# Altium schematic sheet chaves.SchDoc
size A3 portrait; SheetNumber: 4; SheetTotal: 7
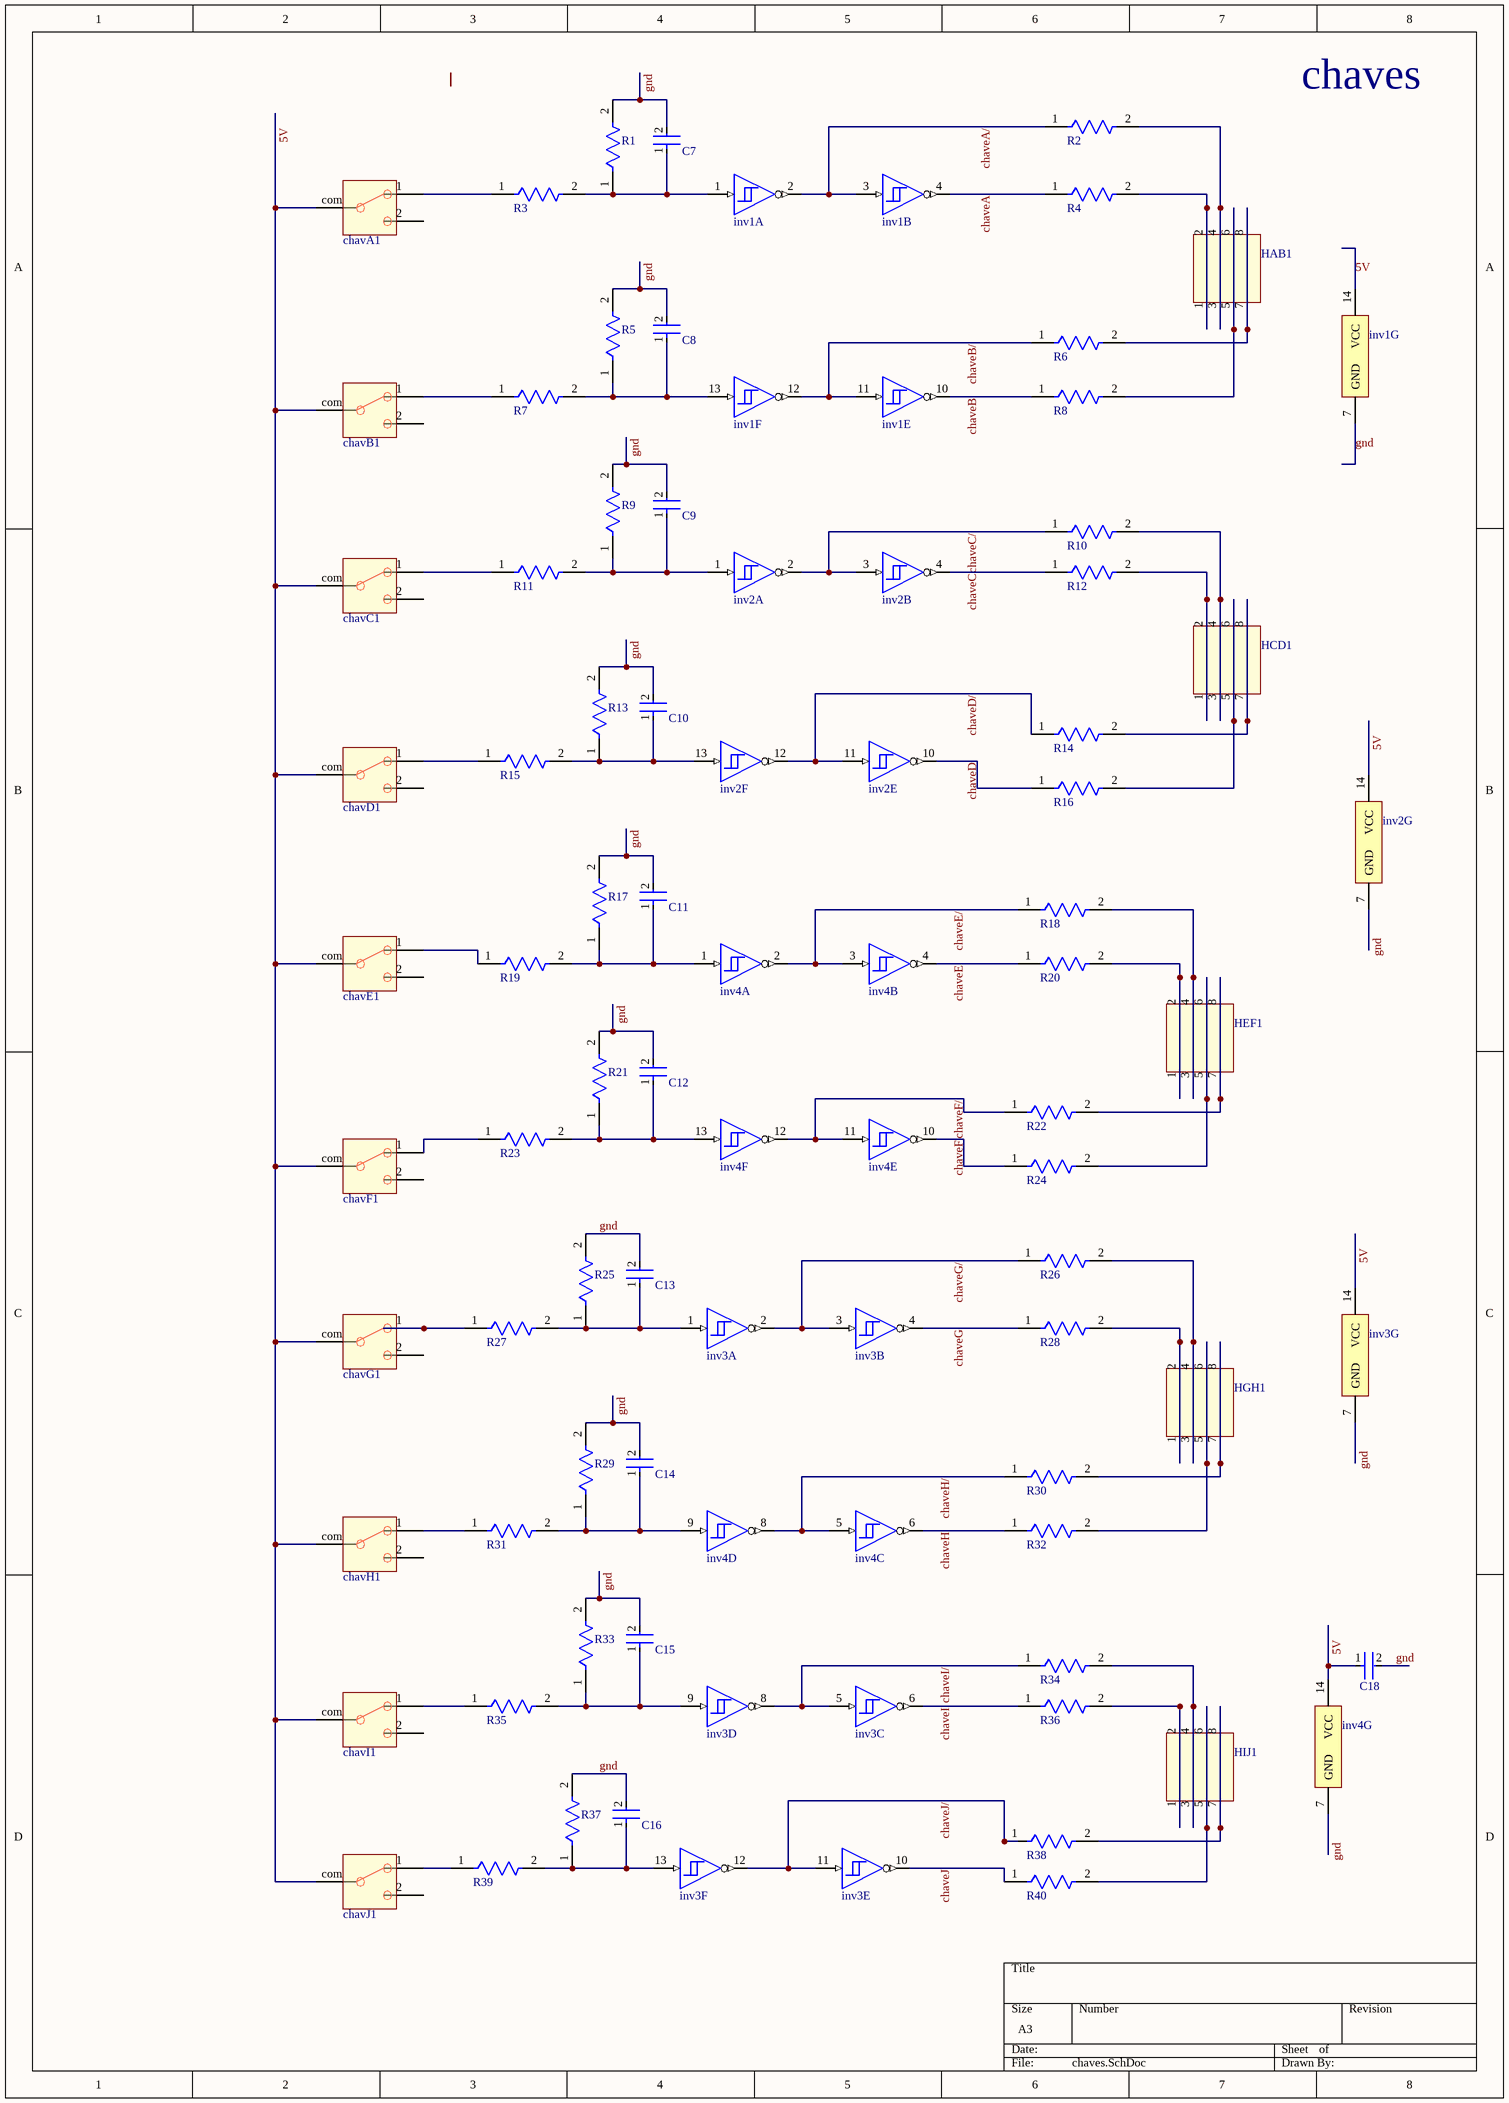
[diagram p0: chaves.SchDoc]

## Parts
C7  RCER71H335K3K1H03B  [FP-RCE3M1-MFG]  (value not drawn)
C8  RCER71H335K3K1H03B  [FP-RCE3M1-MFG]  (value not drawn)
C9  RCER71H335K3K1H03B  [FP-RCE3M1-MFG]  (value not drawn)
C10  RCER71H335K3K1H03B  [FP-RCE3M1-MFG]  (value not drawn)
C11  RCER71H335K3K1H03B  [FP-RCE3M1-MFG]  (value not drawn)
C12  RCER71H335K3K1H03B  [FP-RCE3M1-MFG]  (value not drawn)
C13  RCER71H335K3K1H03B  [FP-RCE3M1-MFG]  (value not drawn)
C14  RCER71H335K3K1H03B  [FP-RCE3M1-MFG]  (value not drawn)
C15  RCER71H335K3K1H03B  [FP-RCE3M1-MFG]  (value not drawn)
C16  RCER71H335K3K1H03B  [FP-RCE3M1-MFG]  (value not drawn)
C18  RCER71H335K3K1H03B  [FP-RCE3M1-MFG]  (value not drawn)
chavA1  chave MTS-102  [MTS-102]  (value not drawn)
chavB1  chave MTS-102  [MTS-102]  (value not drawn)
chavC1  chave MTS-102  [MTS-102]  (value not drawn)
chavD1  chave MTS-102  [MTS-102]  (value not drawn)
chavE1  chave MTS-102  [MTS-102]  (value not drawn)
chavF1  chave MTS-102  [MTS-102]  (value not drawn)
chavG1  chave MTS-102  [MTS-102]  (value not drawn)
chavH1  chave MTS-102  [MTS-102]  (value not drawn)
chavI1  chave MTS-102  [MTS-102]  (value not drawn)
chavJ1  chave MTS-102  [MTS-102]  (value not drawn)
HAB1  header 2x4  [header 2x4]  (value not drawn)
HCD1  header 2x4  [header 2x4]  (value not drawn)
HEF1  header 2x4  [header 2x4]  (value not drawn)
HGH1  header 2x4  [header 2x4]  (value not drawn)
HIJ1  header 2x4  [header 2x4]  (value not drawn)
inv1  SN74HC14N  [N0014A]  (value not drawn)  (parts A,B,E,F,G of 7)
inv2  SN74HC14N  [N0014A]  (value not drawn)  (parts A,B,E,F,G of 7)
inv3  SN74HC14N  [N0014A]  (value not drawn)  (parts A,B,C,D,E,F,G of 7)
inv4  SN74HC14N  [N0014A]  (value not drawn)  (parts A,B,C,D,E,F,G of 7)
R1  MRS16000C2002FCT00  [FP-MRS1600-MFG]  (value not drawn)
R2  MRS16000C2002FCT00  [FP-MRS1600-MFG]  (value not drawn)
R3  MRS16000C2002FCT00  [FP-MRS1600-MFG]  (value not drawn)
R4  MRS16000C2002FCT00  [FP-MRS1600-MFG]  (value not drawn)
R5  MRS16000C2002FCT00  [FP-MRS1600-MFG]  (value not drawn)
R6  MRS16000C2002FCT00  [FP-MRS1600-MFG]  (value not drawn)
R7  MRS16000C2002FCT00  [FP-MRS1600-MFG]  (value not drawn)
R8  MRS16000C2002FCT00  [FP-MRS1600-MFG]  (value not drawn)
R9  MRS16000C2002FCT00  [FP-MRS1600-MFG]  (value not drawn)
R10  MRS16000C2002FCT00  [FP-MRS1600-MFG]  (value not drawn)
R11  MRS16000C2002FCT00  [FP-MRS1600-MFG]  (value not drawn)
R12  MRS16000C2002FCT00  [FP-MRS1600-MFG]  (value not drawn)
R13  MRS16000C2002FCT00  [FP-MRS1600-MFG]  (value not drawn)
R14  MRS16000C2002FCT00  [FP-MRS1600-MFG]  (value not drawn)
R15  MRS16000C2002FCT00  [FP-MRS1600-MFG]  (value not drawn)
R16  MRS16000C2002FCT00  [FP-MRS1600-MFG]  (value not drawn)
R17  MRS16000C2002FCT00  [FP-MRS1600-MFG]  (value not drawn)
R18  MRS16000C2002FCT00  [FP-MRS1600-MFG]  (value not drawn)
R19  MRS16000C2002FCT00  [FP-MRS1600-MFG]  (value not drawn)
R20  MRS16000C2002FCT00  [FP-MRS1600-MFG]  (value not drawn)
R21  MRS16000C2002FCT00  [FP-MRS1600-MFG]  (value not drawn)
R22  MRS16000C2002FCT00  [FP-MRS1600-MFG]  (value not drawn)
R23  MRS16000C2002FCT00  [FP-MRS1600-MFG]  (value not drawn)
R24  MRS16000C2002FCT00  [FP-MRS1600-MFG]  (value not drawn)
R25  MRS16000C2002FCT00  [FP-MRS1600-MFG]  (value not drawn)
R26  MRS16000C2002FCT00  [FP-MRS1600-MFG]  (value not drawn)
R27  MRS16000C2002FCT00  [FP-MRS1600-MFG]  (value not drawn)
R28  MRS16000C2002FCT00  [FP-MRS1600-MFG]  (value not drawn)
R29  MRS16000C2002FCT00  [FP-MRS1600-MFG]  (value not drawn)
R30  MRS16000C2002FCT00  [FP-MRS1600-MFG]  (value not drawn)
R31  MRS16000C2002FCT00  [FP-MRS1600-MFG]  (value not drawn)
R32  MRS16000C2002FCT00  [FP-MRS1600-MFG]  (value not drawn)
R33  MRS16000C2002FCT00  [FP-MRS1600-MFG]  (value not drawn)
R34  MRS16000C2002FCT00  [FP-MRS1600-MFG]  (value not drawn)
R35  MRS16000C2002FCT00  [FP-MRS1600-MFG]  (value not drawn)
R36  MRS16000C2002FCT00  [FP-MRS1600-MFG]  (value not drawn)
R37  MRS16000C2002FCT00  [FP-MRS1600-MFG]  (value not drawn)
R38  MRS16000C2002FCT00  [FP-MRS1600-MFG]  (value not drawn)
R39  MRS16000C2002FCT00  [FP-MRS1600-MFG]  (value not drawn)
R40  MRS16000C2002FCT00  [FP-MRS1600-MFG]  (value not drawn)

## Nets
5V: C18.1 chavA1.com chavB1.com chavC1.com chavD1.com chavE1.com chavF1.com chavG1.com chavH1.com chavI1.com chavJ1.com inv1.14(VCC) inv2.14(VCC) inv3.14(VCC) inv4.14(VCC)
chaveA: inv1.4(~{2Y}) R4.1
chaveA/: inv1.2(~{1Y}) inv1.3(2A) R2.1
chaveB: inv1.10(~{5Y}) R8.1
chaveB/: inv1.11(5A) inv1.12(~{6Y}) R6.1
chaveC: inv2.4(~{2Y}) R12.1
chaveC/: inv2.2(~{1Y}) inv2.3(2A) R10.1
chaveD: inv2.10(~{5Y}) R16.1
chaveD/: inv2.11(5A) inv2.12(~{6Y}) R14.1
chaveE: inv4.4(~{2Y}) R20.1
chaveE/: inv4.2(~{1Y}) inv4.3(2A) R18.1
chaveF: inv4.10(~{5Y}) R24.1
chaveF/: inv4.11(5A) inv4.12(~{6Y}) R22.1
chaveG: inv3.4(~{2Y}) R28.1
chaveG/: inv3.2(~{1Y}) inv3.3(2A) R26.1
chaveH: inv4.6(~{3Y}) R32.1
chaveH/: inv4.5(3A) inv4.8(~{4Y}) R30.1
chaveI: inv3.6(~{3Y}) R36.1
chaveI/: inv3.5(3A) inv3.8(~{4Y}) R34.1
chaveJ: inv3.10(~{5Y}) R40.1
chaveJ/: inv3.11(5A) inv3.12(~{6Y}) R38.1
gnd: C7.2 C8.2 C9.2 C10.2 C11.2 C12.2 C13.2 C14.2 C15.2 C16.2 C18.2 inv1.7(GND) inv2.7(GND) inv3.7(GND) inv4.7(GND) R1.2 R5.2 R9.2 R13.2 R17.2 R21.2 R25.2 R29.2 R33.2 R37.2
NetC7_1: C7.1 inv1.1(1A) R1.1 R3.2
NetC8_1: C8.1 inv1.13(6A) R5.1 R7.2
NetC9_1: C9.1 inv2.1(1A) R9.1 R11.2
NetC10_1: C10.1 inv2.13(6A) R13.1 R15.2
NetC11_1: C11.1 inv4.1(1A) R17.1 R19.2
NetC12_1: C12.1 inv4.13(6A) R21.1 R23.2
NetC13_1: C13.1 inv3.1(1A) R25.1 R27.2
NetC14_1: C14.1 inv4.9(4A) R29.1 R31.2
NetC15_1: C15.1 inv3.9(4A) R33.1 R35.2
NetC16_1: C16.1 inv3.13(6A) R37.1 R39.2
NetchavA1_1: chavA1.1 R3.1
NetchavB1_1: chavB1.1 R7.1
NetchavC1_1: chavC1.1 R11.1
NetchavD1_1: chavD1.1 R15.1
NetchavE1_1: chavE1.1 R19.1
NetchavF1_1: chavF1.1 R23.1
NetchavG1_1: chavG1.1 R27.1
NetchavH1_1: chavH1.1 R31.1
NetchavI1_1: chavI1.1 R35.1
NetchavJ1_1: chavJ1.1 R39.1
NetHAB1_1: HAB1.1 HAB1.2 R4.2
NetHAB1_3: HAB1.3 HAB1.4 R2.2
NetHAB1_5: HAB1.5 HAB1.6 R8.2
NetHAB1_7: HAB1.7 HAB1.8 R6.2
NetHCD1_1: HCD1.1 HCD1.2 R12.2
NetHCD1_3: HCD1.3 HCD1.4 R10.2
NetHCD1_5: HCD1.5 HCD1.6 R16.2
NetHCD1_7: HCD1.7 HCD1.8 R14.2
NetHEF1_1: HEF1.1 HEF1.2 R20.2
NetHEF1_3: HEF1.3 HEF1.4 R18.2
NetHEF1_5: HEF1.5 HEF1.6 R24.2
NetHEF1_7: HEF1.7 HEF1.8 R22.2
NetHGH1_1: HGH1.1 HGH1.2 R28.2
NetHGH1_3: HGH1.3 HGH1.4 R26.2
NetHGH1_5: HGH1.5 HGH1.6 R32.2
NetHGH1_7: HGH1.7 HGH1.8 R30.2
NetHIJ1_1: HIJ1.1 HIJ1.2 R36.2
NetHIJ1_3: HIJ1.3 HIJ1.4 R34.2
NetHIJ1_5: HIJ1.5 HIJ1.6 R40.2
NetHIJ1_7: HIJ1.7 HIJ1.8 R38.2

Not connected (* = marked no-connect by the designer): chavA1 2; chavB1 2; chavC1 2; chavD1 2; chavE1 2; chavF1 2; chavG1 2; chavH1 2; chavI1 2; chavJ1 2

## Notes on the sheet
- chaves

## Library data of the parts
C7-C16 C18 = CMP-06035-028451-1: Cap Ceramic 3.3uF 50V X7R ±10% Radial 5mm +125°C Automotive Ammo Pack; Lead Diameter: 0.5mm; Lead/Base Style: Formed Leads; Height: 5mm; Ratings: AEC-Q200; Capacitance: 3.3uF; Package Quantity: 500; Length: 0.217inch; Min Operating Temperature: -55°C; Voltage Rating (DC): 50V; Dielectric: X7R; Case/Package: Radial; Height - Seated (Max): 0.197inch; Termination: Radial; Mount: Through Hole; Max Operating Temperature: 125°C; Width: 0.157inch; Voltage Rating: 50V; Packaging: Bulk; Resistor Type: Ceramic; Tolerance: 10%; Lead Pitch: 0.197inch
chavA1 chavB1 chavC1 chavD1 chavE1 chavF1 chavG1 chavH1 chavI1 chavJ1 = MTS-102: chave caso seja usadsada sendo encaixada; pin to pad: 1>C2 2>com com>C3; Parameter 1: MTS-102
HAB1 HCD1 HEF1 HGH1 HIJ1 = header 2x4: header male 2x4; pin to pad: 1>C1 2>C2 3>C3 4>C4 5>C5 6>C6 7>C7 8>C8; Parameter 1: header 2x4
inv1-inv4 = CMP-1615-00889-3: Hex Schmitt-Trigger Inverters, N0014A, TUBE; Manufacturer: Texas Instruments; Input Type: CMOS; Voltage(Nom)(V): 5; VCC(Min)(V): 2; tpd @ Nom Voltage(Max)(ns): 31; Technology Family: HC; VCC(Max)(V): 6; F @ Nom Voltage(Max)(Mhz): 20; Output Drive (IOL/IOH)(Max)(mA): -4/4; Rating: Catalog; Schmitt Trigger: Yes; ICC @ Nom Voltage(Max)(mA): 0.02; PackageReference: N0014A; Code_JEDEC: MS-001; Operating Temperature Range(C): -40 to 85; Generic Part Number: SN74HC14; Bits(#): 6; DatasheetVersion: SCLS085G; Output Type: CMOS
R1-R40 = CMP-02408-000019-1: RES 20K OHM 0.4W 1% AXIAL; Max Power Dissipation: 400mW; Temperature Coefficient: 50ppm/°C; Resistance: 20kR; Technology: THIN FILM; Max Operating Temperature: 155°C; Number of Terminations: 2; RoHS Compliant: Yes; Packaging: Tape and Reel; Radiation Hardening: No; Contact Plating: Tin; Military Standard: Not; Construction: Cylindrical; Diameter: 1.6mm; Tolerance: 1%; Mount: Through Hole; Power Rating: 400mW; Case/Package: Conformal; Termination: Axial; Length: 3.6mm; Min Operating Temperature: -55°C; Resistor Type: Metal Film; Series: MRS16